# Altium schematic sheet PMT_Gain.SchDoc
size A4; SheetNumber: 1; SheetTotal: 1
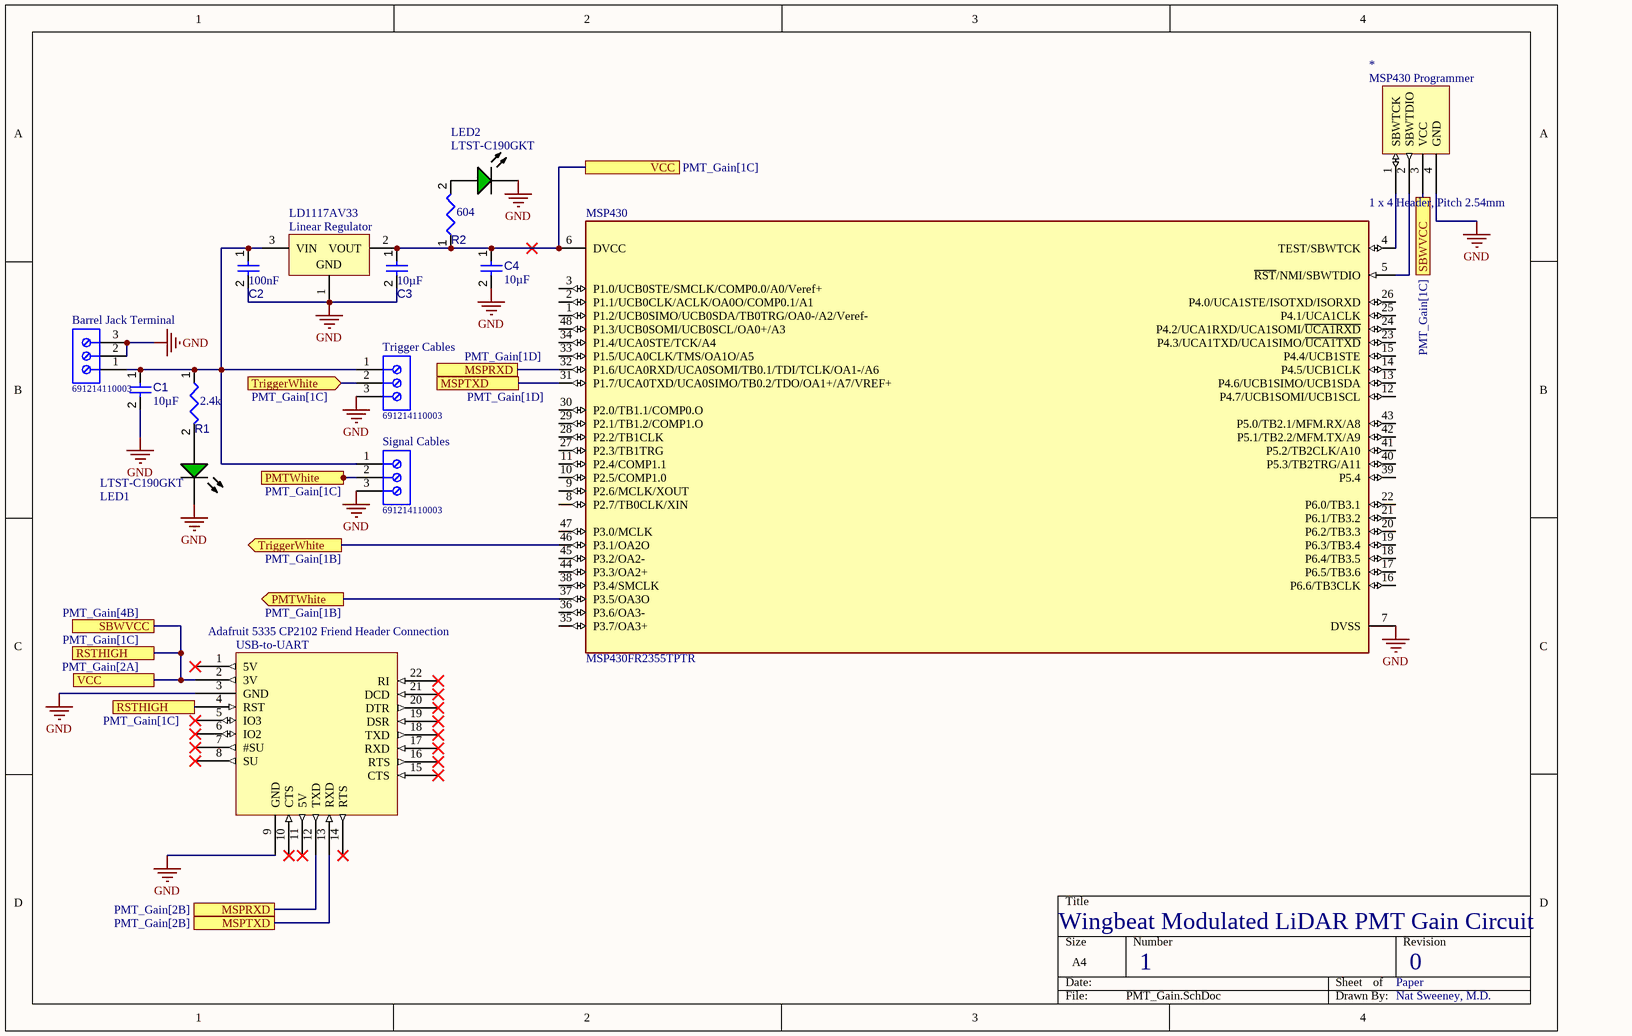
[diagram p0: PMT_Gain.SchDoc]

## Parts
*  1 x 4 Header, Pitch 2.54mm  [1 x 4 Header, Pitch 2.54mm-Footprint-1]
Barrel_Jack_Terminal  691214110003  [691214110003]
C1  value 10µF  [CAPC0805(2012)145_L]  (hidden comment: Capacitor 10µF +/-20% 25V 0805)
C2  value 100nF  [CAPC2013X95X50LL10T25]  (hidden comment: Capacitor 100 nF +/-10% 50 V 0805)
C3  value 10µF  [CAPC0805(2012)145_L]  (hidden comment: Capacitor 10µF +/-20% 25V 0805)
C4  value 10µF  [CAPC0805(2012)145_L]  (hidden comment: Capacitor 10µF +/-20% 25V 0805)
LED1  LTST-C190GKT  [LTST-C190GKT_V]
LED2  LTST-C190GKT  [LTST-C190GKT_V]
Linear_Regulator  LD1117AV33  [TO220]
MSP430  MSP430FR2355TPTR  [FP-PT0048A-IPC_A]
R1  value 2.4k  [FP-CRCW0603-e3-IPC_C]  (hidden comment: CRCW06032K40FKEA)
R2  value 604  [RESC3216X60X45NL10T20]  (hidden comment: CRCW1206604RFKEA)
Signal_Cables  691214110003  [691214110003]
Trigger_Cables  691214110003  [691214110003]
USB-to-UART  Adafruit 5335 CP2102 Friend Header Connection  [2.54mm, 1x8 Male Pin Header Generic-Footprint-1]

## Ports
MSPRXD (see PMT_Gain[1D]), MSPRXD (see PMT_Gain[2B]), MSPTXD (see PMT_Gain[1D]), MSPTXD (see PMT_Gain[2B]), PMTWhite (in, see PMT_Gain[1C]), PMTWhite (out, see PMT_Gain[1B]), RSTHIGH (see PMT_Gain[1C]), SBWVCC (see PMT_Gain[1C]), SBWVCC (see PMT_Gain[4B]), TriggerWhite (in, see PMT_Gain[1C]), TriggerWhite (out, see PMT_Gain[1B]), VCC (see PMT_Gain[1C]), VCC (see PMT_Gain[2A])

## Nets
GND: *.4(GND) Barrel_Jack_Terminal.2 Barrel_Jack_Terminal.3 C1.2 C2.2 C3.2 C4.2 LED1.2(K) LED2.2(K) Linear_Regulator.1(GND) MSP430.7(DVSS) Signal_Cables.3 Trigger_Cables.3 USB-to-UART.3(GND) USB-to-UART.9(GND)
MSPRXD: MSP430.32(P1.6/UCA0RXD/UCA0SOMI/TB0.1/TDI/TCLK/OA1-/A6) USB-to-UART.12(TXD) ; port MSPRXD
MSPTXD: MSP430.31(P1.7/UCA0TXD/UCA0SIMO/TB0.2/TDO/OA1+/A7/VREF+) USB-to-UART.13(RXD) ; port MSPTXD
PMTWhite: MSP430.37(P3.5/OA3O) Signal_Cables.2 ; port PMTWhite
RSTHIGH: *.3(VCC) C3.1 C4.1 Linear_Regulator.2(VOUT) MSP430.6(DVCC) R2.1 USB-to-UART.2(3V) USB-to-UART.4(RST) ; port VCC, port RSTHIGH, port SBWVCC
TriggerWhite: MSP430.46(P3.1/OA2O) Trigger_Cables.2 ; port TriggerWhite
Net*_1: *.1(SBWTCK) MSP430.4(TEST/SBWTCK)
Net*_2: *.2(SBWTDIO) MSP430.5(~{RST}/NMI/SBWTDIO)
NetBarrel_Jack_Terminal_1: Barrel_Jack_Terminal.1 C1.1 C2.1 Linear_Regulator.3(VIN) R1.1 Signal_Cables.1 Trigger_Cables.1
NetLED1_1: LED1.1(A) R1.2
NetLED2_1: LED2.1(A) R2.2

Not connected (* = marked no-connect by the designer): MSP430 1(P1.2/UCB0SIMO/UCB0SDA/TB0TRG/OA0-/A2/Veref-) 2(P1.1/UCB0CLK/ACLK/OA0O/COMP0.1/A1) 3(P1.0/UCB0STE/SMCLK/COMP0.0/A0/Veref+) 8(P2.7/TB0CLK/XIN) 9(P2.6/MCLK/XOUT) 10(P2.5/COMP1.0) 11(P2.4/COMP1.1) 12(P4.7/UCB1SOMI/UCB1SCL) 13(P4.6/UCB1SIMO/UCB1SDA) 14(P4.5/UCB1CLK) 15(P4.4/UCB1STE) 16(P6.6/TB3CLK) 17(P6.5/TB3.6) 18(P6.4/TB3.5) 19(P6.3/TB3.4) 20(P6.2/TB3.3) 21(P6.1/TB3.2) 22(P6.0/TB3.1) 23(P4.3/UCA1TXD/UCA1SIMO/~{UCA1TXD}) 24(P4.2/UCA1RXD/UCA1SOMI/~{UCA1RXD}) 25(P4.1/UCA1CLK) 26(P4.0/UCA1STE/ISOTXD/ISORXD) 27(P2.3/TB1TRG) 28(P2.2/TB1CLK) 29(P2.1/TB1.2/COMP1.O) 30(P2.0/TB1.1/COMP0.O) 33(P1.5/UCA0CLK/TMS/OA1O/A5) 34(P1.4/UCA0STE/TCK/A4) 35(P3.7/OA3+) 36(P3.6/OA3-) 38(P3.4/SMCLK) 39(P5.4) 40(P5.3/TB2TRG/A11) 41(P5.2/TB2CLK/A10) 42(P5.1/TB2.2/MFM.TX/A9) 43(P5.0/TB2.1/MFM.RX/A8) 44(P3.3/OA2+) 45(P3.2/OA2-) 47(P3.0/MCLK) 48(P1.3/UCB0SOMI/UCB0SCL/OA0+/A3); USB-to-UART 1(5V)* 5(IO3)* 6(IO2)* 7(#SU)* 8(SU)* 10(CTS)* 11(5V)* 14(RTS)* 15(CTS)* 16(RTS)* 17(RXD)* 18(TXD)* 19(DSR)* 20(DTR)* 21(DCD)* 22(RI)*

## Notes on the sheet
- Wingbeat Modulated LiDAR PMT Gain Circuit
- 1
- Paper
- 0
- Nat Sweeney, M.D.
- (in symbol CMP-002-00074-2) MSP430 Programmer

## Library data of the parts
* = CMP-002-00074-2
Barrel_Jack_Terminal Signal_Cables Trigger_Cables = CMP-002-00071-1: 2141 Series 3.5mm Pitch Straight; PCB Terminal Block; Through Hole; 3 Way; RoHS Compliant: Yes
C1 C3 C4 = CMP-001-00079-4: Chip Capacitor, 10µF +/-20%, 25V, 0805, Thickness 1.45 mm; Tolerance: 10%; Max Operating Temperature: 85°C; Case/Package: 0805; Voltage Rating: 25V; Min Operating Temperature: -55°C; Mounting Technology: SMT; Pins: 2
C2 = CMP-001-00018-6: Chip Capacitor, 100 nF, +/- 10%, 50 V, 0805 (2012 Metric); Capacitor Type: Ceramic; Voltage Rating: 50V; Pins: 2; Max Operating Temperature: 125°C; Min Operating Temperature: -55°C; Mounting Technology: SM; Case/Package: 0805; RoHS Compliant: True; Tolerance: 10%
LED1 LED2 = CMP-007-00022-2: LED Uni-Color Green, 100 mW, 30 mA, -55 to 85 degC, 2-Pin SMD, RoHS, Tape and Reel; Manufacturer: Lite-On; Power: 100mW; Forward Voltage: 2.1V; Viewing Angle: 130degrees; Forward Current: 20mA; Luminous Intensity: 6mcd; Lens Style: Clear; Manufacturer URL: http://www.us.liteon.com/; RoHS Compliant: True; Colour: Green; Package Description: 2-Pin Surface Mount Device, Body 1.6 x 0.8 mm; Datasheet URL: http://datasheet.octopart.com/LTST-C190GKT-Lite-On-datasheet-158530.pdf; Datasheet Version: Dec-06; Mounting Technology: SM; Case/Package: 0603; Package Reference: C190GKT; Packaging: TapeandReel; Min Operating Temperature: -55°C; Nominal Vf: 2.1V; Package Quantity: 3000; Illumination Colour: Green; Max Operating Temperature: 85°C; Pins: 2
Linear_Regulator = CMP-019-00052-1: LD1117 Series 1 A 3.3 V Fixed Output Positive Voltage LDO Regulator - TO-220; Max Supply Voltage: 10V; Pins: 3; RoHS Compliant: Yes; Case/Package: TO-220
MSP430 = CMP-020-00023-1: RISC Microcontroller, 16-Bit, FRAM, MSP430 CPU, 24MHz, CMOS, PQFP48; RoHS Compliant: Yes
R1 = CMP-009-00177-1: Fixed Resistor, Metal Glaze/thick Film, 0.1W, 2400ohm, 75V, 1% +/-Tol, 100ppm/Cel, Surface Mount, 0603; Power: 100mW; Tolerance: 1%; Case/Package: 0603; RoHS Compliant: Yes; Max Operating Temperature: 155°C; Pins: 2; Mounting Technology: Surface Mount; Min Operating Temperature: -55°C
R2 = CMP-009-00178-1: Fixed Resistor, Metal Glaze/thick Film, 0.25W, 604ohm, 200V, 1% +/-Tol, 100ppm/Cel, Surface Mount, 1206; Power: 250mW; Min Operating Temperature: -55°C; Pins: 2; Tolerance: 1%; Mounting Technology: Surface Mount; Max Operating Temperature: 155°C; Case/Package: 1206; RoHS Compliant: Yes
USB-to-UART = 5335-2: Connection to Adafruit 5335 to PCB